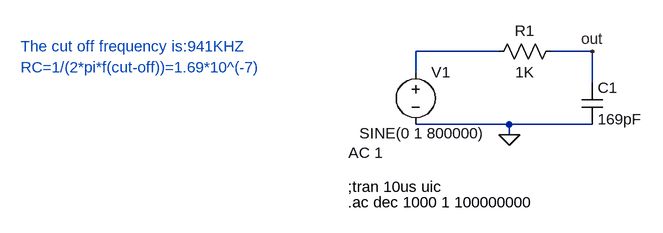
[diagram p0: schematic LTspice_20320941.asc]
LTspice_20320941.asc, the LTspice schematic file:
Version 4
SHEET 1 880 680
WIRE -16 -48 -144 -48
WIRE 128 -48 64 -48
WIRE -144 -16 -144 -48
WIRE 128 0 128 -48
WIRE 0 64 -144 64
WIRE 128 64 0 64
WIRE 0 80 0 64
FLAG 0 80 0
FLAG 128 -48 out
SYMBOL cap 112 0 R0
WINDOW 0 55 8 Right 2
SYMATTR InstName C1
SYMATTR Value 169pF
SYMBOL res 80 -64 R90
WINDOW 0 0 56 VBottom 2
WINDOW 3 32 56 VTop 2
SYMATTR InstName R1
SYMATTR Value 1K
SYMATTR SpiceLine tol=1 pwr=0.1
SYMBOL voltage -144 -32 R0
WINDOW 3 107 110 Right 2
WINDOW 123 -50 140 Right 2
WINDOW 39 0 0 Left 0
SYMATTR Value SINE(0 1 800000)
SYMATTR Value2 AC 1
SYMATTR InstName V1
TEXT -248 160 Left 2 !;tran 10us uic
TEXT -248 184 Left 2 !.ac dec 1000 1 100000000
TEXT -752 -56 Left 2 ;The cut off frequency is:941KHZ
TEXT -752 -24 Left 2 ;RC=1/(2*pi*f(cut-off))=1.69*10^(-7)

The netlist it stands for:
* LTspice_20320941.asc
C1 out 0 169pF
R1 out N001 1K tol=1 pwr=0.1
V1 N001 0 SINE(0 1 800000) AC 1
;tran 10us uic
.ac dec 1000 1 100000000
* The cut off frequency is:941KHZ
* RC=1/(2*pi*f(cut-off))=1.69*10^(-7)
.backanno
.end